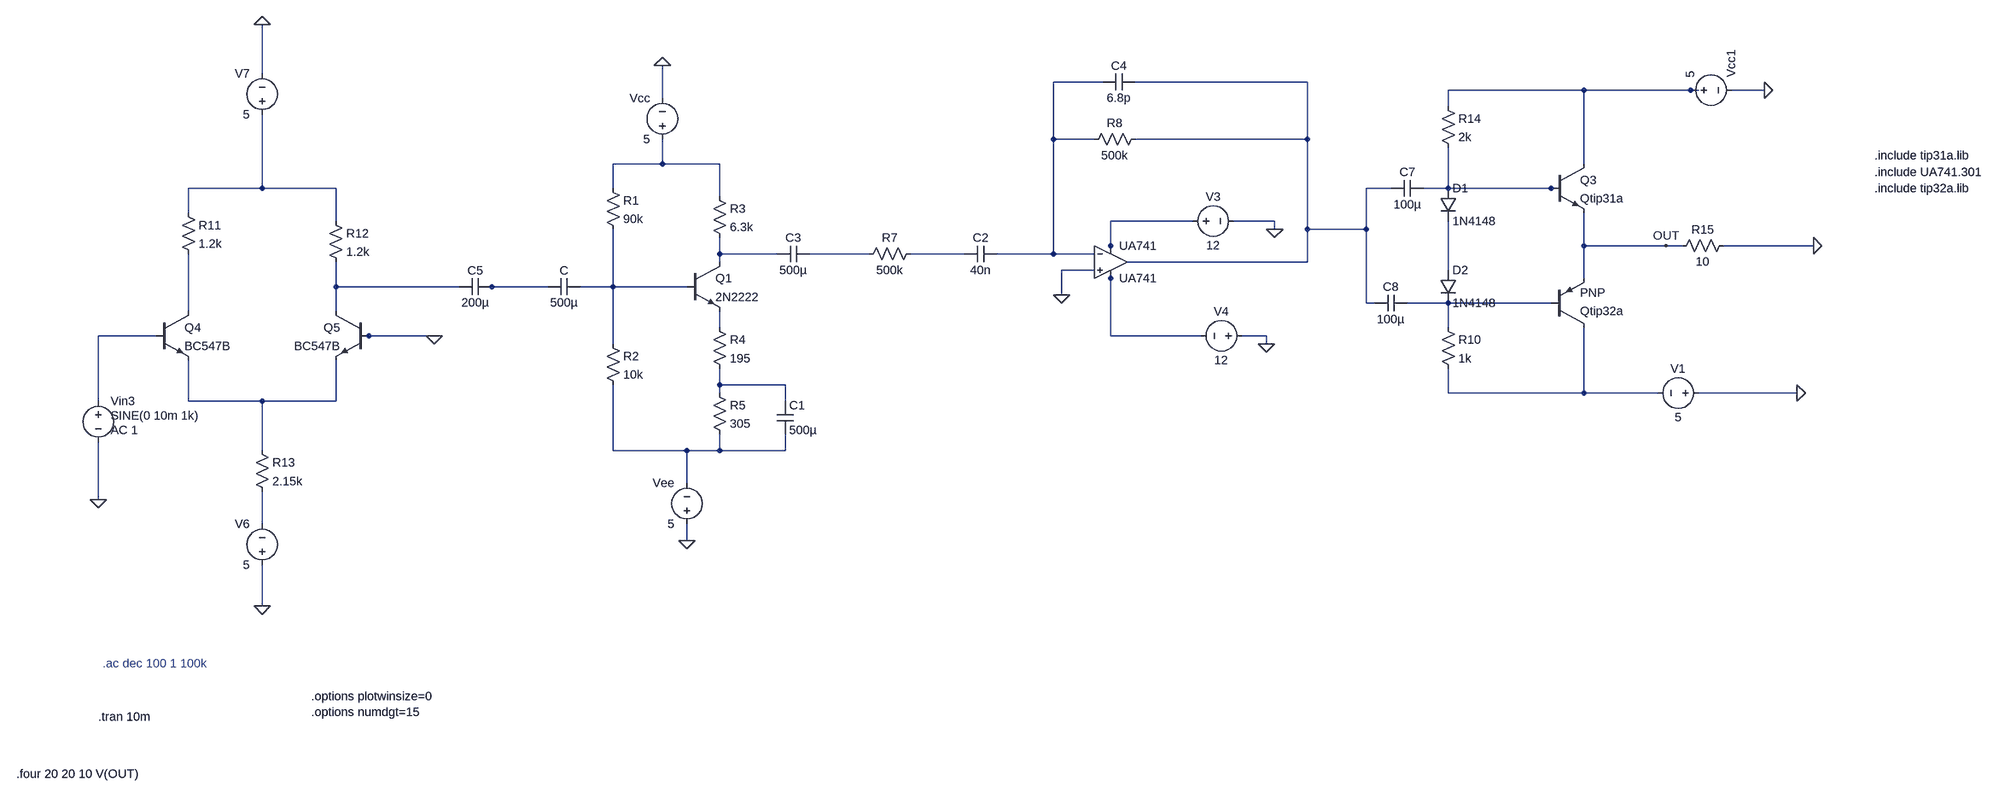
[diagram p0: schematic final draft.asc]
final draft.asc, the LTspice schematic file:
Version 4.1
SHEET 1 3356 1560
WIRE -784 -176 -784 -272
WIRE 1392 -160 1296 -160
WIRE 1792 -160 1456 -160
WIRE 2432 -144 2112 -144
WIRE 2640 -144 2432 -144
WIRE 2656 -144 2640 -144
WIRE 2784 -144 2720 -144
WIRE 224 -128 224 -192
WIRE 2112 -112 2112 -144
WIRE 1296 -48 1296 -160
WIRE 1376 -48 1296 -48
WIRE 1792 -48 1792 -160
WIRE 1792 -48 1456 -48
WIRE 224 0 224 -48
WIRE 224 0 128 0
WIRE 336 0 224 0
WIRE 2432 0 2432 -144
WIRE -784 48 -784 -96
WIRE -784 48 -928 48
WIRE -640 48 -784 48
WIRE 128 48 128 0
WIRE 2000 48 1952 48
WIRE 2112 48 2112 -32
WIRE 2112 48 2064 48
WIRE 2368 48 2112 48
WIRE 2384 48 2368 48
WIRE 336 64 336 0
WIRE -928 96 -928 48
WIRE -640 112 -640 48
WIRE 1568 112 1408 112
WIRE 1728 112 1648 112
WIRE 1728 128 1728 112
WIRE 1792 128 1792 -48
WIRE 1952 128 1952 48
WIRE 1952 128 1792 128
WIRE 1408 160 1408 112
WIRE 2432 160 2432 96
WIRE 2592 160 2432 160
WIRE 2624 160 2592 160
WIRE 2880 160 2704 160
WIRE 336 176 336 144
WIRE 448 176 336 176
WIRE 880 176 512 176
WIRE 1072 176 960 176
WIRE 1296 176 1296 -48
WIRE 1296 176 1136 176
WIRE 1376 176 1296 176
WIRE 1408 176 1408 160
WIRE 336 192 336 176
WIRE 1792 192 1792 128
WIRE 1792 192 1440 192
WIRE 1376 208 1312 208
WIRE 2112 208 2112 112
WIRE 1408 224 1408 208
WIRE 2432 224 2432 160
WIRE -640 240 -640 192
WIRE -400 240 -640 240
WIRE -336 240 -352 240
WIRE 0 240 -336 240
WIRE 128 240 128 128
WIRE 128 240 64 240
WIRE 272 240 128 240
WIRE 1312 256 1312 208
WIRE 1952 272 1952 128
WIRE 1968 272 1952 272
WIRE 2112 272 2032 272
WIRE 2368 272 2112 272
WIRE -928 288 -928 176
WIRE -640 288 -640 240
WIRE 336 320 336 288
WIRE 2112 320 2112 272
WIRE -992 336 -1104 336
WIRE -576 336 -592 336
WIRE -448 336 -576 336
WIRE -432 336 -448 336
WIRE 1408 336 1408 224
WIRE 1584 336 1408 336
WIRE 1712 336 1664 336
WIRE 128 352 128 240
WIRE 1712 352 1712 336
WIRE 336 432 336 400
WIRE 464 432 336 432
WIRE 336 448 336 432
WIRE 2112 448 2112 400
WIRE 2432 448 2432 320
WIRE 2432 448 2112 448
WIRE 2576 448 2432 448
WIRE 2848 448 2656 448
WIRE -1104 464 -1104 336
WIRE -928 464 -928 384
WIRE -784 464 -928 464
WIRE -640 464 -640 384
WIRE -640 464 -784 464
WIRE 464 464 464 432
WIRE -784 560 -784 464
WIRE 128 560 128 432
WIRE 272 560 128 560
WIRE 336 560 336 528
WIRE 336 560 272 560
WIRE 464 560 464 528
WIRE 464 560 336 560
WIRE 272 624 272 560
WIRE -1104 656 -1104 544
WIRE -784 704 -784 640
WIRE 272 736 272 704
WIRE -784 864 -784 784
FLAG 272 736 0
FLAG 224 -192 0
FLAG 1712 352 0
FLAG 1728 128 0
FLAG -1104 656 0
FLAG -784 -272 0
FLAG -784 864 0
FLAG 2880 160 0
FLAG 2848 448 0
FLAG 2784 -144 0
FLAG 1312 256 0
FLAG 2592 160 OUT
FLAG -448 336 0
SYMBOL res 112 32 R0
SYMATTR InstName R1
SYMATTR Value 90k
SYMBOL res 112 336 R0
SYMATTR InstName R2
SYMATTR Value 10k
SYMBOL npn 272 192 R0
SYMATTR InstName Q1
SYMATTR Value 2N2222
SYMBOL res 320 48 R0
SYMATTR InstName R3
SYMATTR Value 6.3k
SYMBOL res 320 304 R0
SYMATTR InstName R4
SYMATTR Value 195
SYMBOL res 320 432 R0
SYMATTR InstName R5
SYMATTR Value 305
SYMBOL cap 448 464 R0
SYMATTR InstName C1
SYMATTR Value 500µ
SYMBOL voltage 224 -32 R180
WINDOW 0 24 96 Left 2
WINDOW 3 24 16 Left 2
WINDOW 123 0 0 Left 0
WINDOW 39 0 0 Left 0
SYMATTR InstName Vcc
SYMATTR Value 5
SYMBOL cap 64 224 R90
WINDOW 0 0 32 VBottom 2
WINDOW 3 32 32 VTop 2
SYMATTR InstName C
SYMATTR Value 500µ
SYMBOL cap 512 160 R90
WINDOW 0 0 32 VBottom 2
WINDOW 3 32 32 VTop 2
SYMATTR InstName C3
SYMATTR Value 500µ
SYMBOL voltage 272 720 R180
WINDOW 0 24 96 Left 2
WINDOW 3 24 16 Left 2
WINDOW 123 0 0 Left 0
WINDOW 39 0 0 Left 0
SYMATTR InstName Vee
SYMATTR Value 5
SYMBOL res 976 160 R90
WINDOW 0 0 56 VBottom 2
WINDOW 3 32 56 VTop 2
SYMATTR InstName R7
SYMATTR Value 500k
SYMBOL res 1472 -64 R90
WINDOW 0 0 56 VBottom 2
WINDOW 3 32 56 VTop 2
SYMATTR InstName R8
SYMATTR Value 500k
SYMBOL cap 1136 160 R90
WINDOW 0 0 32 VBottom 2
WINDOW 3 32 32 VTop 2
SYMATTR InstName C2
SYMATTR Value 40n
SYMBOL cap 1456 -176 R90
WINDOW 0 0 32 VBottom 2
WINDOW 3 32 32 VTop 2
SYMATTR InstName C4
SYMATTR Value 6.8p
SYMBOL voltage 1552 112 R270
WINDOW 0 32 56 VTop 2
WINDOW 3 -32 56 VBottom 2
WINDOW 123 0 0 Left 0
WINDOW 39 0 0 Left 0
SYMATTR InstName V3
SYMATTR Value 12
SYMBOL voltage 1680 336 R90
WINDOW 0 -32 56 VBottom 2
WINDOW 3 32 56 VTop 2
WINDOW 123 0 0 Left 0
WINDOW 39 0 0 Left 0
SYMATTR InstName V4
SYMATTR Value 12
SYMBOL voltage -1104 448 R0
WINDOW 3 24 44 Left 2
WINDOW 123 24 72 Left 2
WINDOW 39 0 0 Left 0
SYMATTR Value SINE(0 10m 1k)
SYMATTR Value2 AC 1
SYMATTR InstName Vin3
SYMBOL npn -992 288 R0
SYMATTR InstName Q4
SYMATTR Value BC547B
SYMBOL res -944 80 R0
SYMATTR InstName R11
SYMATTR Value 1.2k
SYMBOL res -656 96 R0
SYMATTR InstName R12
SYMATTR Value 1.2k
SYMBOL npn -576 288 M0
SYMATTR InstName Q5
SYMATTR Value BC547B
SYMBOL res -800 544 R0
SYMATTR InstName R13
SYMATTR Value 2.15k
SYMBOL voltage -784 800 R180
WINDOW 0 24 96 Left 2
WINDOW 3 24 16 Left 2
WINDOW 123 0 0 Left 0
WINDOW 39 0 0 Left 0
SYMATTR InstName V6
SYMATTR Value 5
SYMBOL voltage -784 -80 R180
WINDOW 0 24 96 Left 2
WINDOW 3 24 16 Left 2
WINDOW 123 0 0 Left 0
WINDOW 39 0 0 Left 0
SYMATTR InstName V7
SYMATTR Value 5
SYMBOL res 2096 304 R0
SYMATTR InstName R10
SYMATTR Value 1k
SYMBOL res 2096 -128 R0
SYMATTR InstName R14
SYMATTR Value 2k
SYMBOL res 2720 144 R90
WINDOW 0 0 56 VBottom 2
WINDOW 3 32 56 VTop 2
SYMATTR InstName R15
SYMATTR Value 10
SYMBOL voltage 2624 -144 R270
WINDOW 0 24 96 Left 2
WINDOW 3 24 16 Left 2
WINDOW 123 0 0 Left 0
WINDOW 39 0 0 Left 0
SYMATTR InstName Vcc1
SYMATTR Value 5
SYMBOL diode 2096 48 R0
SYMATTR InstName D1
SYMATTR Value 1N4148
SYMBOL diode 2096 208 R0
SYMATTR InstName D2
SYMATTR Value 1N4148
SYMBOL OpAmps\\opamp2 1408 128 R0
SYMATTR InstName UA741
SYMATTR Value UA741
SYMBOL npn 2368 0 R0
SYMATTR InstName Q3
SYMATTR Value Qtip31a
SYMBOL pnp 2368 320 M180
SYMATTR InstName Qtip32a
SYMBOL cap 2032 256 R90
WINDOW 0 0 32 VBottom 2
WINDOW 3 32 32 VTop 2
SYMATTR InstName C8
SYMATTR Value 100µ
SYMBOL cap 2064 32 R90
WINDOW 0 0 32 VBottom 2
WINDOW 3 32 32 VTop 2
SYMATTR InstName C7
SYMATTR Value 100µ
SYMBOL voltage 2672 448 R90
WINDOW 0 -32 56 VBottom 2
WINDOW 3 32 56 VTop 2
WINDOW 123 0 0 Left 0
WINDOW 39 0 0 Left 0
SYMATTR InstName V1
SYMATTR Value 5
SYMBOL cap -336 224 R90
WINDOW 0 0 32 VBottom 2
WINDOW 3 32 32 VTop 2
SYMATTR InstName C5
SYMATTR Value 200µ
TEXT 3128 16 Left 2 !.include UA741.301
TEXT 3128 -16 Left 2 !.include tip31a.lib
TEXT 3128 48 Left 2 !.include tip32a.lib
TEXT -1104 1080 Left 2 !.tran 10m
TEXT -1264 1192 Left 2 !.four 20 20 10 V(OUT)
TEXT -1096 976 Left 2 ;.ac dec 100 1 100k
TEXT -688 1040 Left 2 !.options plotwinsize=0\n.options numdgt=15

The netlist it stands for:
* final draft.asc
R1 N004 N015 90k
R2 N015 N023 10k
Q1 N008 N015 N018 0 2N2222
R3 N004 N008 6.3k
R4 N018 N020 195
R5 N020 N023 305
C1 N020 N023 500µ
Vcc N004 0 5
C N015 N014 500µ
C3 N009 N008 500µ
Vee 0 N023 5
R7 N010 N009 500k
R8 N002 N001 500k
C2 N001 N010 40n
C4 N002 N001 6.8p
V3 N007 0 12
V4 0 N012 12
Vin3 N019 0 SINE(0 10m 1k) AC 1
Q4 N017 N019 N022 0 BC547B
R11 N005 N017 1.2k
R12 N005 N013 1.2k
Q5 N013 0 N022 0 BC547B
R13 N022 N024 2.15k
V6 0 N024 5
V7 N005 0 5
R10 N016 N021 1k
R14 N003 N006 2k
R15 0 OUT 10
Vcc1 N003 0 5
D1 N006 N011 1N4148
D2 N011 N016 1N4148
X§UA741 0 N001 N007 N012 N002 UA741  ; pins In+ In- V+ V- OUT
Q3 N003 N006 OUT 0 Qtip31a
Qtip32a N021 N016 OUT 0 PNP
C8 N016 N002 100µ
C7 N006 N002 100µ
V1 0 N021 5
C5 N014 N013 200µ
.model D D
.lib standard.dio
.model NPN NPN
.model PNP PNP
.lib standard.bjt
.include UA741.301
.include tip31a.lib
.include tip32a.lib
.tran 10m
.four 20 20 10 V(OUT)
* .ac dec 100 1 100k
.options plotwinsize=0
.options numdgt=15
.backanno
.end